# EasyEDA Pro project MSDRV4.eprj, board PCB10
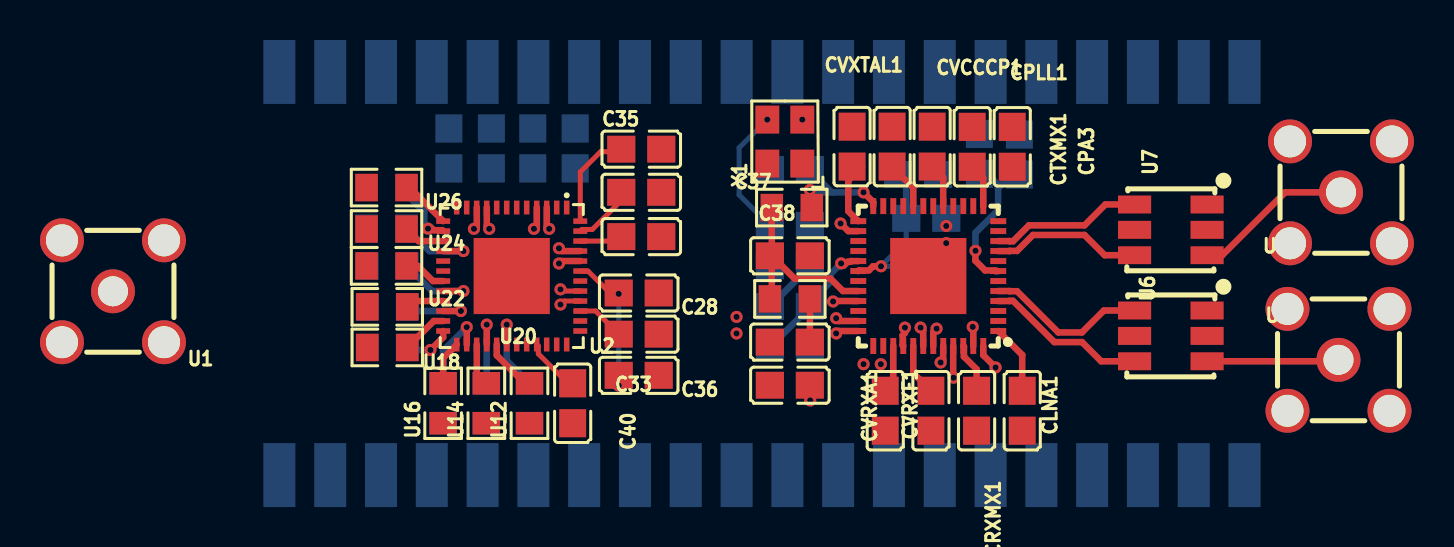
[diagram p4: board, top side]
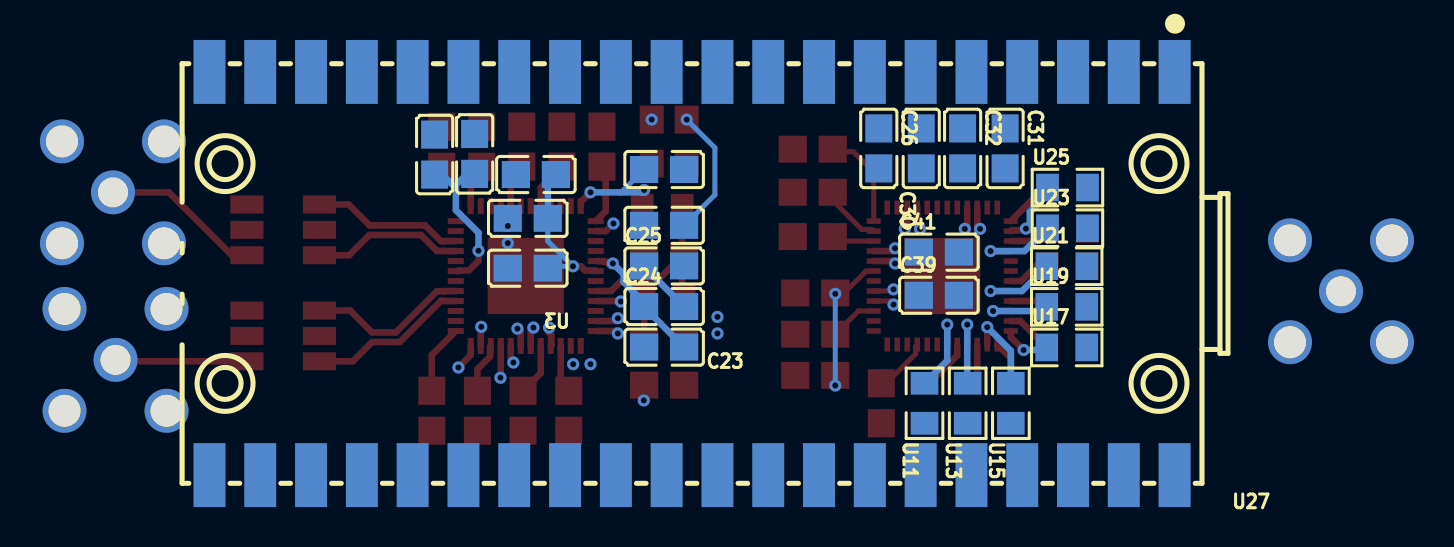
[diagram p5: board, bottom side, seen from below]

No outline. copper layers: Top Layer, Inner1, Inner2, Inner3, Inner4, Bottom Layer. Coordinates in mm from the lowest, leftmost part position.
Stack: Top Layer 0.035mm Outer layer thickness 1oz / Dielectric1 0.0994mm 3313 RC57% 4.2mil / Inner1 0.0152mm Inner layer thickness / Dielectric2 0.55mm 0.55mm H/H No copper / Inner2 0.0152mm Inner layer thickness / Dielectric3 0.1088mm 2116 RC54% 4.9mil / Inner3 0.0152mm Inner layer thickness / Dielectric4 0.55mm 0.55mm H/H No copper / Inner4 0.0152mm Inner layer thickness / Dielectric5 0.0994mm 3313 RC57% 4.2mil / Bottom Layer 0.035mm Outer layer thickness 1oz

## Design rules (mm)
net $1I297\RXP: $1I297\RX
net $1I297\RXN: $1I297\RX
net $1I297\TXP: $1I297\TX
net $1I297\TXN: $1I297\TX
net RXQN: RXQ
net RXQP: RXQ
net RXIN: RXI
net RXIP: RXI
net TXQN: TXQ
net TXQP: TXQ
net TXIN: TXI
net TXIP: TXI
template: JLCPCB Capability(Two Layers Board)
spacing copperThickness1oz (default): track to track 0.102, other pairs 0.152 to 0.3
spacing copperThickness2oz: track to track 0.203, other pairs 0.152 to 0.3
track width copperThickness1oz (default): min 0.127, default 0.254, max 2.54
track width copperThickness2oz: min 0.203, default 0.254, max 2.54
differential pair differentialPair (default): width min 0.127, default 0.254, max 2.54; gap min 0.152, default 0.152
via viaSize (default): diameter min 0.5, default 0.61, max 10; hole min 0.3, default 0.305, max 6.3

## Placement (name value [footprint] x y rotation side)
C18  100nF  [C0805]  33.85 1.28 0 top
C19  1nF  [C0805]  33.85 9.28 0 bottom
C20  100pF  [C0805]  33.85 12.07 0 bottom
C21  2200pF  [C0805]  33.85 3.44 0 top
C22  68pF  [C0805]  33.85 7.75 180 top
C23  18pF  [C0805]  33.85 3.18 0 bottom
C24  100nF  [C0805]  33.85 5.21 180 bottom
C25  100nF  [C0805]  33.85 7.25 180 bottom
C26  330nF  [C0805]  23.11 13.13 270 bottom
C28  100nF  [C0805]  26.29 5.89 180 top
C30  100nF  [C0805]  20.99 13.13 90 bottom
C31  100nF  [C0805]  16.8 13.13 270 bottom
C32  100nF  [C0805]  18.92 13.13 270 bottom
C33  100nF  [C0805]  26.29 3.83 0 top
C35  330nF  [C0805]  26.42 13.09 0 top
C36  100nF  [C0805]  26.29 1.77 180 top
C37  330nF  [C0805]  26.42 10.93 180 top
C38  100nF  [C0805]  26.42 8.71 180 top
C39  100nF  [C0805]  20.11 5.78 180 bottom
C40  100nF  [C0805]  22.99 0.37 90 top
C41  100nF  [C0805]  20.11 7.94 180 bottom
CLNA1  100pF  [C0805]  45.47 0 270 top
CPA1  10uF  [C0805]  43.32 12.85 90 bottom
CPA2  10uF  [C0805]  45.32 12.82 90 bottom
CPA3  100nF  [C0805]  44.97 13.21 90 top
CPLL1  100pF  [C0805]  40.96 13.22 90 top
CRXMX1  100pF  [C0805]  43.18 0 270 top
CTXMX1  100pF  [C0805]  42.96 13.21 90 top
CVCCCP1  10nF  [C0805]  38.96 13.22 90 top
CVCO0  100pF  [C0805]  40.67 9.63 0 bottom
CVCO1  100pF  [C0805]  40.66 7.13 0 bottom
CVCO2  100pF  [C0805]  40.26 11.82 0 bottom
CVRXA1  100pF  [C0805]  38.62 0 270 top
CVRXF1  100pF  [C0805]  40.9 0 270 top
CVXTAL1  100pF  [C0805]  36.96 13.22 90 top
U1  MCX5.08-H5  [SMA-TH_MCX5.08-H5]  0 5.98 180 top
U2  MAX5864ETM+  [QFN-48_L7.0-W7.0-P0.50-BL-EP5.1]  19.94 6.74 180 top
U3  MAX2831ETM+T  [TQFN-48_L7.0-W7.0-P0.50-TL-EP5.6]  40.77 6.74 180 top
U4  MCX5.08-H5  [SMA-TH_MCX5.08-H5]  61.28 2.55 0 top
U5  MCX5.08-H5  [SMA-TH_MCX5.08-H5]  61.41 10.93 0 top
U6  TCM2-43X+  [IND-SMD_6P-L4.1-W3.8-P1.27-TL]  52.9 3.74 270 top
U7  TCM2-43X+  [IND-SMD_6P-L4.1-W3.8-P1.27-TL]  52.9 9.05 270 top
U8  1.2K  [R0805]  33.85 5.59 0 top
U9  750  [R0805]  33.94 10.17 0 top
U11  100  [R0805]  20.83 0.37 90 bottom
U12  100  [R0805]  20.83 0.37 90 top
U13  100  [R0805]  18.67 0.37 90 bottom
U14  100  [R0805]  18.67 0.37 90 top
U15  100  [R0805]  16.51 0.37 90 bottom
U16  100  [R0805]  16.51 0.37 90 top
U17  100  [R0805]  13.71 3.17 180 bottom
U18  100  [R0805]  13.71 3.17 180 top
U19  100  [R0805]  13.71 5.2 180 bottom
U20  100  [R0805]  13.71 5.2 180 top
U21  100  [R0805]  13.71 7.23 180 bottom
U22  100  [R0805]  13.68 7.25 180 top
U23  100  [R0805]  13.68 9.14 180 bottom
U24  100  [R0805]  13.68 9.09 180 top
U25  100  [R0805]  13.68 11.17 180 bottom
U26  100  [R0805]  13.68 11.17 180 top
U27  PICO  [comm-smd_l51.0-w21.0-p2.54_sc0916]  32.77 6.87 0 bottom
X1  40MHz  [OSC-SMD_4P-L3.2-W2.5-BL]  33.59 13.47 90 top

## Footprints (pads in the part's own frame, mm; a bottom-side part is the same pattern mirrored in y, then rotated)
C0805
  rect 1.41x1.35 smd: 1(-1,0) 2(1,0)
comm-smd_l51.0-w21.0-p2.54_sc0916
  rect 1.6x3.2 smd: 1(-24.445,-10.088) 2(-21.905,-10.088) 3(-19.365,-10.088) 4(-16.825,-10.088) 5(-14.285,-10.088) 6(-11.745,-10.088) 7(-9.205,-10.088) 8(-6.665,-10.088) 9(-4.125,-10.088) 10(-1.585,-10.088) 11(0.955,-10.088) 12(3.495,-10.088) 13(6.035,-10.088) 14(8.575,-10.088) 15(11.115,-10.088) 16(13.655,-10.088) 17(16.195,-10.088) 18(18.735,-10.088) 19(21.275,-10.088) 20(23.815,-10.088) 21(23.815,10.088) 22(21.275,10.088) 23(18.735,10.088) 24(16.195,10.088) 25(13.655,10.088) 26(11.115,10.088) 27(8.575,10.088) 28(6.035,10.088) 29(3.495,10.088) 30(0.955,10.088) 31(-1.585,10.088) 32(-4.125,10.088) 33(-6.665,10.088) 34(-9.205,10.088) 35(-11.745,10.088) 36(-14.285,10.088) 37(-16.825,10.088) 38(-19.365,10.088) 39(-21.905,10.088) 40(-24.445,10.088)
IND-SMD_6P-L4.1-W3.8-P1.27-TL
  rect 0.9x1.657 smd: 1(-1.27,1.813) 2(0,1.813) 3(1.27,1.813) 4(1.27,-1.813) 5(0,-1.813) 6(-1.27,-1.813)
OSC-SMD_4P-L3.2-W2.5-BL
  rect 1.4x1.2 smd: 1(-1.1,-0.875) 2(1.1,-0.875) 3(1.1,0.875) 4(-1.1,0.875)
QFN-48_L7.0-W7.0-P0.50-BL-EP5.1
  rect 0.28x0.7 smd: 1(-2.75,-3.428) 2(-2.25,-3.428) 3(-1.75,-3.428) 4(-1.25,-3.428) 5(-0.75,-3.428) 6(-0.25,-3.428) 7(0.25,-3.428) 8(0.75,-3.428) 9(1.25,-3.428) 10(1.75,-3.428) 11(2.25,-3.428) 12(2.75,-3.428) 25(2.75,3.428) 26(2.25,3.428) 27(1.75,3.428) 28(1.25,3.428) 29(0.75,3.428) 30(0.25,3.428) 31(-0.25,3.428) 32(-0.75,3.428) 33(-1.25,3.428) 34(-1.75,3.428) 35(-2.25,3.428) 36(-2.75,3.428)
  rect 0.7x0.28 smd: 13(3.428,-2.75) 14(3.428,-2.25) 15(3.428,-1.75) 16(3.428,-1.25) 17(3.428,-0.75) 18(3.428,-0.25) 19(3.428,0.25) 20(3.428,0.75) 21(3.428,1.25) 22(3.428,1.75) 23(3.428,2.25) 24(3.428,2.75) 37(-3.428,2.75) 38(-3.428,2.25) 39(-3.428,1.75) 40(-3.428,1.25) 41(-3.428,0.75) 42(-3.428,0.25) 43(-3.428,-0.25) 44(-3.428,-0.75) 45(-3.428,-1.25) 46(-3.428,-1.75) 47(-3.428,-2.25) 48(-3.428,-2.75)
  rect 3.81x3.81 smd: 49(0,0)
R0805
  rect 1.133x1.377 smd: 1(-1,0) 2(1,0)
SMA-TH_MCX5.08-H5
  round 2.2 hole 1.6: 1(-2.55,-2.55) 2(-2.55,2.55) 3(2.55,2.55) 4(2.55,-2.55)
  round 2.2 hole 1.5: 5(0,0)
TQFN-48_L7.0-W7.0-P0.50-TL-EP5.6
  rect 0.8x0.3 smd: 1(-3.5,2.751) 2(-3.5,2.251) 3(-3.5,1.75) 4(-3.5,1.251) 5(-3.5,0.75) 6(-3.5,0.252) 7(-3.5,-0.249) 8(-3.5,-0.75) 9(-3.5,-1.25) 10(-3.5,-1.75) 11(-3.5,-2.249) 12(-3.5,-2.748) 25(3.5,-2.748) 26(3.5,-2.249) 27(3.5,-1.75) 28(3.5,-1.25) 29(3.5,-0.75) 30(3.5,-0.249) 31(3.5,0.252) 32(3.5,0.75) 33(3.5,1.251) 34(3.5,1.75) 35(3.5,2.251) 36(3.5,2.751)
  rect 0.3x0.8 smd: 13(-2.751,-3.5) 14(-2.251,-3.5) 15(-1.75,-3.5) 16(-1.25,-3.5) 17(-0.75,-3.5) 18(-0.251,-3.5) 19(0.249,-3.5) 20(0.75,-3.5) 21(1.25,-3.5) 22(1.75,-3.5) 23(2.251,-3.5) 24(2.751,-3.5) 37(2.751,3.5) 38(2.251,3.5) 39(1.75,3.5) 40(1.25,3.5) 41(0.75,3.5) 42(0.251,3.5) 43(-0.251,3.5) 44(-0.75,3.5) 45(-1.25,3.5) 46(-1.75,3.5) 47(-2.251,3.5) 48(-2.751,3.5)
  rect 3.81x3.81 smd: 49(0,0.001)

## Nets
+5V: X1.4
GND: C18.1 C20.1 C21.1 C22.1 C23.2 C26.1 C28.1 C30.2 C31.1 C32.1 C33.2 C35.2 C36.1 C37.1 C38.1 C39.1 C40.1 C41.1 CLNA1.2 CPA1.2 CPA2.2 CPA3.2 CPLL1.2 CRXMX1.2 CTXMX1.2 CVCCCP1.2 CVCO0.2 CVCO1.2 CVCO2.2 CVRXA1.2 CVRXF1.2 CVXTAL1.2 U1.1 U1.2 U1.3 U1.4 U2.5 U2.7 U2.12 U2.31 U2.32 U2.37 U2.42 U3.2 U3.26 U3.31 U3.47 U3.49 U4.1 U4.2 U4.3 U4.4 U5.1 U5.2 U5.3 U5.4 U6.1 U6.2 U7.1 U7.2 X1.2
VCC: C28.2 C30.1 C31.2 C32.2 C33.1 C36.2 C38.2 C39.2 C40.2 C41.2 U2.2 U2.8 U2.11 U2.18 U2.33 U2.39 U2.43 U2.46
3.3: CLNA1.1 CPA1.1 CPA2.1 CPA3.1 CPLL1.1 CRXMX1.1 CTXMX1.1 CVCCCP1.1 CVCO0.1 CVCO1.1 CVCO2.1 CVRXA1.1 CVRXF1.1 CVXTAL1.1 U3.1 U3.7 U3.13 U3.17 U3.20 U3.25 U3.27 U3.30 U3.39 U3.41 U3.46
$1I61\$1N1602: C37.2 U2.47
$1I61\$1N1605: U2.30 U11.2
$1I61\$1N1608: U2.29 U12.2
$1I61\$1N1611: U2.28 U13.2
$1I61\$1N1614: U2.27 U14.2
$1I61\$1N1617: U2.26 U15.2
$1I61\$1N1620: U2.25 U16.2
$1I61\$1N1625: U2.24 U17.1
$1I61\$1N1628: U2.23 U18.1
$1I61\$1N1633: U2.21 U20.1
$1I61\$1N1636: U2.20 U21.1
$1I61\$1N1639: U2.19 U22.1
$1I61\$1N1642: U2.16 U23.1
$1I61\$1N1645: U2.15 U24.1
$1I61\$1N1648: U2.14 U25.1
$1I61\$1N1651: U2.13 U26.1
$1I61\$1N1653: C35.1 U2.48
$1I61\$1N1654: C26.2 U2.1
$1I61\$1N1662: U2.22 U19.1
$1I61\BBC_CLK: U2.6
$1I61\BBC_DA0: U26.2
$1I61\BBC_DA1: U25.2
$1I61\BBC_DA2: U24.2
$1I61\BBC_DA3: U23.2
$1I61\BBC_DA4: U22.2
$1I61\BBC_DA5: U21.2
$1I61\BBC_DA6: U20.2
$1I61\BBC_DA7: U19.2
$1I61\BBC_DD0: U18.2
$1I61\BBC_DD1: U17.2
$1I61\BBC_DD2: U16.1
$1I61\BBC_DD3: U15.1
$1I61\BBC_DD4: U14.1
$1I61\BBC_DD5: U13.1
$1I61\BBC_DD6: U12.1
$1I61\BBC_DD7: U11.1
$1I61\CS#: U2.36
$1I61\DIN: U2.34
$1I61\SCLK: U2.35
$1I297\$1N1513: U4.5 U6.3
$1I297\$1N1514: U5.5 U7.3
$1I297\$1N1515: C21.2 U8.2
$1I297\$1N2254: C23.1 C24.1 U3.29
$1I297\$1N2490: C19.1 X1.3
$1I297\$1N3884: C25.2 U1.5
$1I297\BYPASS: C18.2 U3.33
$1I297\CLKBUF: U3.21
$1I297\CPOUT: C20.2 U3.24 U9.2
$1I297\CS#: U3.15
$1I297\D1: U3.23
$1I297\D2: U3.11
$1I297\D3: U3.8
$1I297\D4: U3.34
$1I297\D5: U3.14
$1I297\D6: U3.3
$1I297\D7: U3.6
$1I297\DIN: U3.19
$1I297\PLL_LOCK: U3.22
$1I297\RSSI: U3.16
$1I297\RXHP: U3.40
$1I297\RXN: U3.5 U6.6
$1I297\RXP: U3.4 U6.4
$1I297\RXTX_MODE: U3.48
$1I297\SCLK: U3.18
$1I297\SHDN#: U3.12 X1.1
$1I297\TUNE: C22.2 U3.32 U8.1 U9.1
$1I297\TXN: U3.10 U7.6
$1I297\TXP: U3.9 U7.4
$1I297\XTAL: C19.2 C24.2 C25.1 U3.28
RXIN: U2.4 U3.37
RXIP: U2.3 U3.38
RXQN: U2.9 U3.35
RXQP: U2.10 U3.36
TXIN: U2.44 U3.44
TXIP: U2.45 U3.45
TXQN: U2.40 U3.42
TXQP: U2.41 U3.43

Pads without a net: U2 17 38 49; U6 5; U7 5; U27 1 2 3 4 5 6 7 8 9 10 11 12 13 14 15 16 17 18 19 20 21 22 23 24 25 26 27 28 29 30 31 32 33 34 35 36 37 38 39 40

## Via types
v1: diameter 0.61, hole 0.305, Top Layer to Bottom Layer, 43 vias

## Routing (per net, layer and track width the routed paths; a pad name or vN(x,y) marks a point on that pad's centre or on a via; arc(x,y) is an arc through that point)
GND: length 2
  Top Layer w0.33: v1(36.38,9.37) 36.39,9.37 36.77,8.99 U3.26 ; v1(42.99,4.2) 43.02,4.17 U3.47
  vias: v1(34.47,14.57) v1(41.66,9.25) v1(41.66,8.39)
VCC: length 13.6
  Top Layer w0.254: C33.1 24.13,4.99 U2.39 ; U2.33 21.27,3.23 21.27,2.85 22.74,1.37 C40.2 ; 24.75,8.49 U2.46 ; v1(25.29,5.85) C28.2 24.85,5.89 23.75,6.99 U2.43
  Bottom Layer w0.254: v1(25.29,1.26) v1(25.29,5.85)
3.3: length 37.3
  Top Layer w0.33: CTXMX1.1 43.52,11.66 U3.13 ; CPLL1.1 41.52,11.66 U3.17 ; v1(43.13,8) 43.12,8 43.12,7.51 43.61,7.02 44.11,7.02 44.14,6.99 44.27,6.99 ; 37.47,12.22 36.77,11.52 36.77,9.99 U3.25 ; v1(38.41,7.23) 38,7.23 37.8,7.02 37.3,7.02 37.27,6.99 ; CLNA1.1 45.47,2.79 U3.1 ; U3.20 40.02,11.16 CVCCCP1.1 ; CVRXF1.1 40.02,1.88 U3.41 ; U3.46 42.55,3.21 42.55,2.71 43.18,2.08 CRXMX1.1 ; CVRXA1.1 39.02,1.4 U3.39
  Bottom Layer w0.254: CVCO1.1 39.57,7.23 v1(38.41,7.23) 39.67,8.49 CVCO0.1
  Bottom Layer w0.33: 44.26,11.14 45.32,12.2 ; 44.26,11.14 44.26,11.3 43.32,12.23 ; 44.26,11.14 44.26,10.04 43.13,8.91 v1(43.13,8) ; CVCO2.1 39.67,11.41 CVCO0.1
$1I61\$1N1602: length 3.1
  Top Layer w0.254: U2.47 23.45,9.07 23.97,9.07 25.29,10.39 25.29,10.8 C37.2
$1I61\$1N1605: length 4.4
  Top Layer w0.33: U2.30 v1(19.69,4.31)
  Bottom Layer w0.33: v1(19.69,4.31) 19.69,2.51 U11.2
$1I61\$1N1608: length 2.8
  Top Layer w0.33: U2.29 19.19,2.77 20.59,1.37 U12.2
$1I61\$1N1611: length 3.9
  Top Layer w0.33: U2.28 v1(18.69,4.31)
  Bottom Layer w0.33: U13.2 18.69,1.4 v1(18.69,4.31)
$1I61\$1N1614: length 2.1
  Top Layer w0.33: U14.2 18.19,1.85 U2.27
$1I61\$1N1617: length 4.2
  Top Layer w0.33: U2.26 v1(17.69,4.18)
  Bottom Layer w0.33: U15.2 16.51,3 v1(17.69,4.18)
$1I61\$1N1620: length 2.2
  Top Layer w0.33: U16.2 16.51,2.63 U2.25
$1I61\$1N1625: length 2.4
  Top Layer w0.33: v1(15.87,3.04) 16.51,3.68 U2.24
  Bottom Layer w0.33: U17.1 14.84,3.04 v1(15.87,3.04)
$1I61\$1N1628: length 2.3
  Top Layer w0.33: U18.1 16.04,4.49 U2.23
$1I61\$1N1633: length 1.9
  Top Layer w0.33: U2.21 15.01,5.49 U20.1
$1I61\$1N1636: length 4.3
  Top Layer w0.33: U2.20 v1(17.52,5.99)
  Bottom Layer w0.33: U21.1 15.96,5.99 v1(17.52,5.99)
$1I61\$1N1639: length 2.1
  Top Layer w0.33: U2.19 16,6.49 15.24,7.25 U22.1
$1I61\$1N1642: length 4.3
  Top Layer w0.33: U2.16 v1(17.52,7.99)
  Bottom Layer w0.33: U23.1 15.83,7.99 v1(17.52,7.99)
$1I61\$1N1645: length 2.1
  Top Layer w0.33: U2.15 15.28,8.49 U24.1
$1I61\$1N1648: length 3.3
  Top Layer w0.33: v1(15.75,9.11) 15.95,9.11 16.03,9.03 16.47,9.03 U2.14
  Bottom Layer w0.33: v1(15.75,9.11) 15.56,9.3 15.56,9.96 14.68,10.84 U25.1
$1I61\$1N1651: length 2.5
  Top Layer w0.33: U2.13 14.83,11.17 U26.1
$1I61\$1N1653: length 4.9
  Top Layer w0.254: 25.42,12.96 24.38,12.96 23.37,11.95 U2.48
$1I61\$1N1662: length 3.7
  Top Layer w0.33: U2.22 v1(17.4,4.99)
  Bottom Layer w0.33: U19.1 14.92,4.99 v1(17.4,4.99)
$1I297\$1N1513: length 6.6
  Top Layer w0.33: U4.5 61.21,2.47 U6.3
$1I297\$1N1514: length 8
  Top Layer w0.33: U5.5 58.61,10.93 55.47,7.78 U7.3
$1I297\$1N1515: length 2.2
  Top Layer w0.33: U8.2 C21.2
$1I297\$1N2254: length 6.7
  Top Layer w0.33: v1(36.41,7.37) 36.51,7.27 36.55,7.27 36.74,7.46 36.87,7.46 36.91,7.49 U3.29
  Bottom Layer w0.33: C23.1 34.85,5.18 C24.1 34.85,5.42 35.87,6.44 35.87,6.83 v1(36.41,7.37)
$1I297\$1N2490: length 6.5
  Bottom Layer w0.254: v1(32.72,14.57) 31.31,13.16 31.31,10.8 32.83,9.28 C19.1
$1I297\BYPASS: length 2
  Top Layer w0.33: C18.2 34.85,0.53 v1(34.86,0.51) ; v1(36.01,5.47) 36.03,5.49 37.27,5.49
$1I297\CPOUT: length 6.2
  Top Layer w0.33: 38.02,10.24 38.02,10.44 v1(37.53,10.93) ; U9.2 34.85,10.26 v1(34.85,11.05)
  Bottom Layer w0.254: 35.99,10.93 C20.2
  Bottom Layer w0.33: v1(37.53,10.93) 34.97,10.93 v1(34.85,11.05)
$1I297\RXHP: length 1
  Top Layer w0.33: v1(39.6,4.16) 39.6,3.89 39.48,3.77 39.48,3.27 U3.40
$1I297\RXN: length 8.1
  Top Layer w0.33: U3.5 44.83,5.99 44.84,5.98 45.21,5.98 47.27,3.92 48.45,3.92 49.55,5.01 U6.6
$1I297\RXP: length 8.1
  Top Layer w0.33: 44.27,5.49 44.83,5.49 44.84,5.5 45.01,5.5 47.07,3.44 48.45,3.44 49.41,2.47 U6.4
$1I297\RXTX_MODE: length 1.3
  Top Layer w0.33: v1(44.13,2.17) 43.52,2.78 U3.48
$1I297\TUNE: length 9.7
  Top Layer w0.33: 32.94,7.75 34.09,6.61 35.88,6.61 36.5,5.99 U3.32 ; 32.94,7.75 32.94,5.69 U8.1 ; 32.94,7.75 U9.1
$1I297\TXN: length 7.6
  Top Layer w0.33: U7.6 49.62,10.32 48.58,9.28 45.8,9.28 45.01,8.48 44.84,8.48 44.83,8.49 U3.10
$1I297\TXP: length 7.6
  Top Layer w0.33: U7.4 49.59,7.78 48.58,8.8 46,8.8 45.21,8 44.84,8 44.83,7.99 U3.9
$1I297\XTAL: length 2.9
  Bottom Layer w0.33: C25.1 34.85,7.21 C24.2
RXIN: length 26.3
  Top Layer w0.33: v1(21.05,9.1) 21.19,9.24 U2.4
  Inner3 w0.33: v1(37.53,2.33) 37.53,2.97 37.72,3.16 37.72,3.49 37.19,4.02 37.19,5.62 36.96,5.85 36.5,5.85 36.27,6.09 35.75,6.09 35.51,5.85 30.73,5.85 29.09,4.21 21.84,4.21 21.19,4.86 21.19,8.33 21.05,8.47 v1(21.05,9.1)
RXIP: length 26.3
  Top Layer w0.33: v1(21.81,9.1) 21.69,9.22 U2.3
  Inner3 w0.33: v1(38.4,2.33) 38.4,2.97 38.2,3.16 38.2,3.69 37.67,4.22 37.67,5.82 37.16,6.33 36.71,6.33 36.47,6.57 35.55,6.57 35.31,6.33 30.53,6.33 28.89,4.69 22.04,4.69 21.67,5.05 21.67,8.33 21.68,8.33 21.68,8.39 21.81,8.52 v1(21.81,9.1)
RXQN: length 22.5
  Top Layer w0.33: U3.35 36.3,4.49 v1(36.16,4.63) ; U2.9 18.69,9.22 v1(18.81,9.1)
  Inner2 w0.33: 30.41,4.56 22.11,4.56 18.81,7.86 v1(18.81,9.1) ; 30.41,4.56 30.55,4.69 v1(31.18,4.69) ; 30.41,4.56 30.48,4.56
  Inner3 w0.33: v1(31.18,4.69) 31.39,4.49 35.39,4.49 35.53,4.63 v1(36.16,4.63)
RXQP: length 23.4
  Top Layer w0.33: v1(36.16,3.87) 36.28,3.99 U3.36 ; v1(18.05,9.1) 18.19,9.24 U2.10
  Inner2 w0.33: 30.41,4.07 30.61,3.87 v1(31.18,3.87) ; 30.41,4.07 21.91,4.07 18.19,7.8 18.19,8.96 v1(18.05,9.1) ; 30.41,4.07 30.48,4.07
  Inner3 w0.33: v1(31.18,3.87) 31.32,4.01 35.39,4.01 35.53,3.87 v1(36.16,3.87)
TXIN: length 25.3
  Top Layer w0.33: U3.44 41.52,2.54 v1(41.39,2.41) ; U2.44 22.42,7.49 v1(22.3,7.37)
  Inner2 w0.33: v1(41.39,2.41) 41.81,2.83 41.81,4.89 40.57,6.13 38.87,6.13 38.86,6.12 37.95,6.12 37.94,6.13 35.23,6.13 33.86,7.51 23.08,7.51 22.94,7.37 v1(22.3,7.37)
TXIP: length 27.5
  Top Layer w0.33: v1(22.3,8.13) 22.44,7.99 U2.45 ; U3.45 42.02,1.67 v1(42.03,1.65)
  Inner2 w0.33: v1(42.03,1.65) 42.29,1.91 42.29,5.09 40.77,6.61 38.67,6.61 38.66,6.61 38.15,6.61 38.14,6.61 35.43,6.61 34.06,7.99 23.08,7.99 22.94,8.13 v1(22.3,8.13)
TXQN: length 24.8
  Top Layer w0.254: U2.40 22.55,5.49 v1(22.38,5.31)
  Top Layer w0.33: v1(40.38,4.16) 40.52,4.03 U3.42
  Inner3 w0.33: v1(22.38,5.31) 23.01,5.31 23.15,5.45 23.68,5.45 26.87,8.64 35.55,8.64 35.92,8.27 36.96,8.27 37.35,7.87 39.12,7.87 40.54,6.44 40.54,4.95 40.38,4.8 v1(40.38,4.16)
TXQP: length 25.6
  Top Layer w0.254: U2.41 22.46,5.99 v1(22.38,6.07)
  Top Layer w0.33: v1(41.18,4.11) 41.02,3.94 U3.43
  Inner3 w0.33: v1(41.18,4.11) 41.18,4.74 41.03,4.9 41.03,6.64 39.32,8.35 37.55,8.35 37.16,8.75 36.12,8.75 35.75,9.13 26.67,9.13 23.48,5.93 23.15,5.93 23.01,6.07 v1(22.38,6.07)
